# EAGLE design LED sign Control board FINAL (EAGLE 7.2.0)
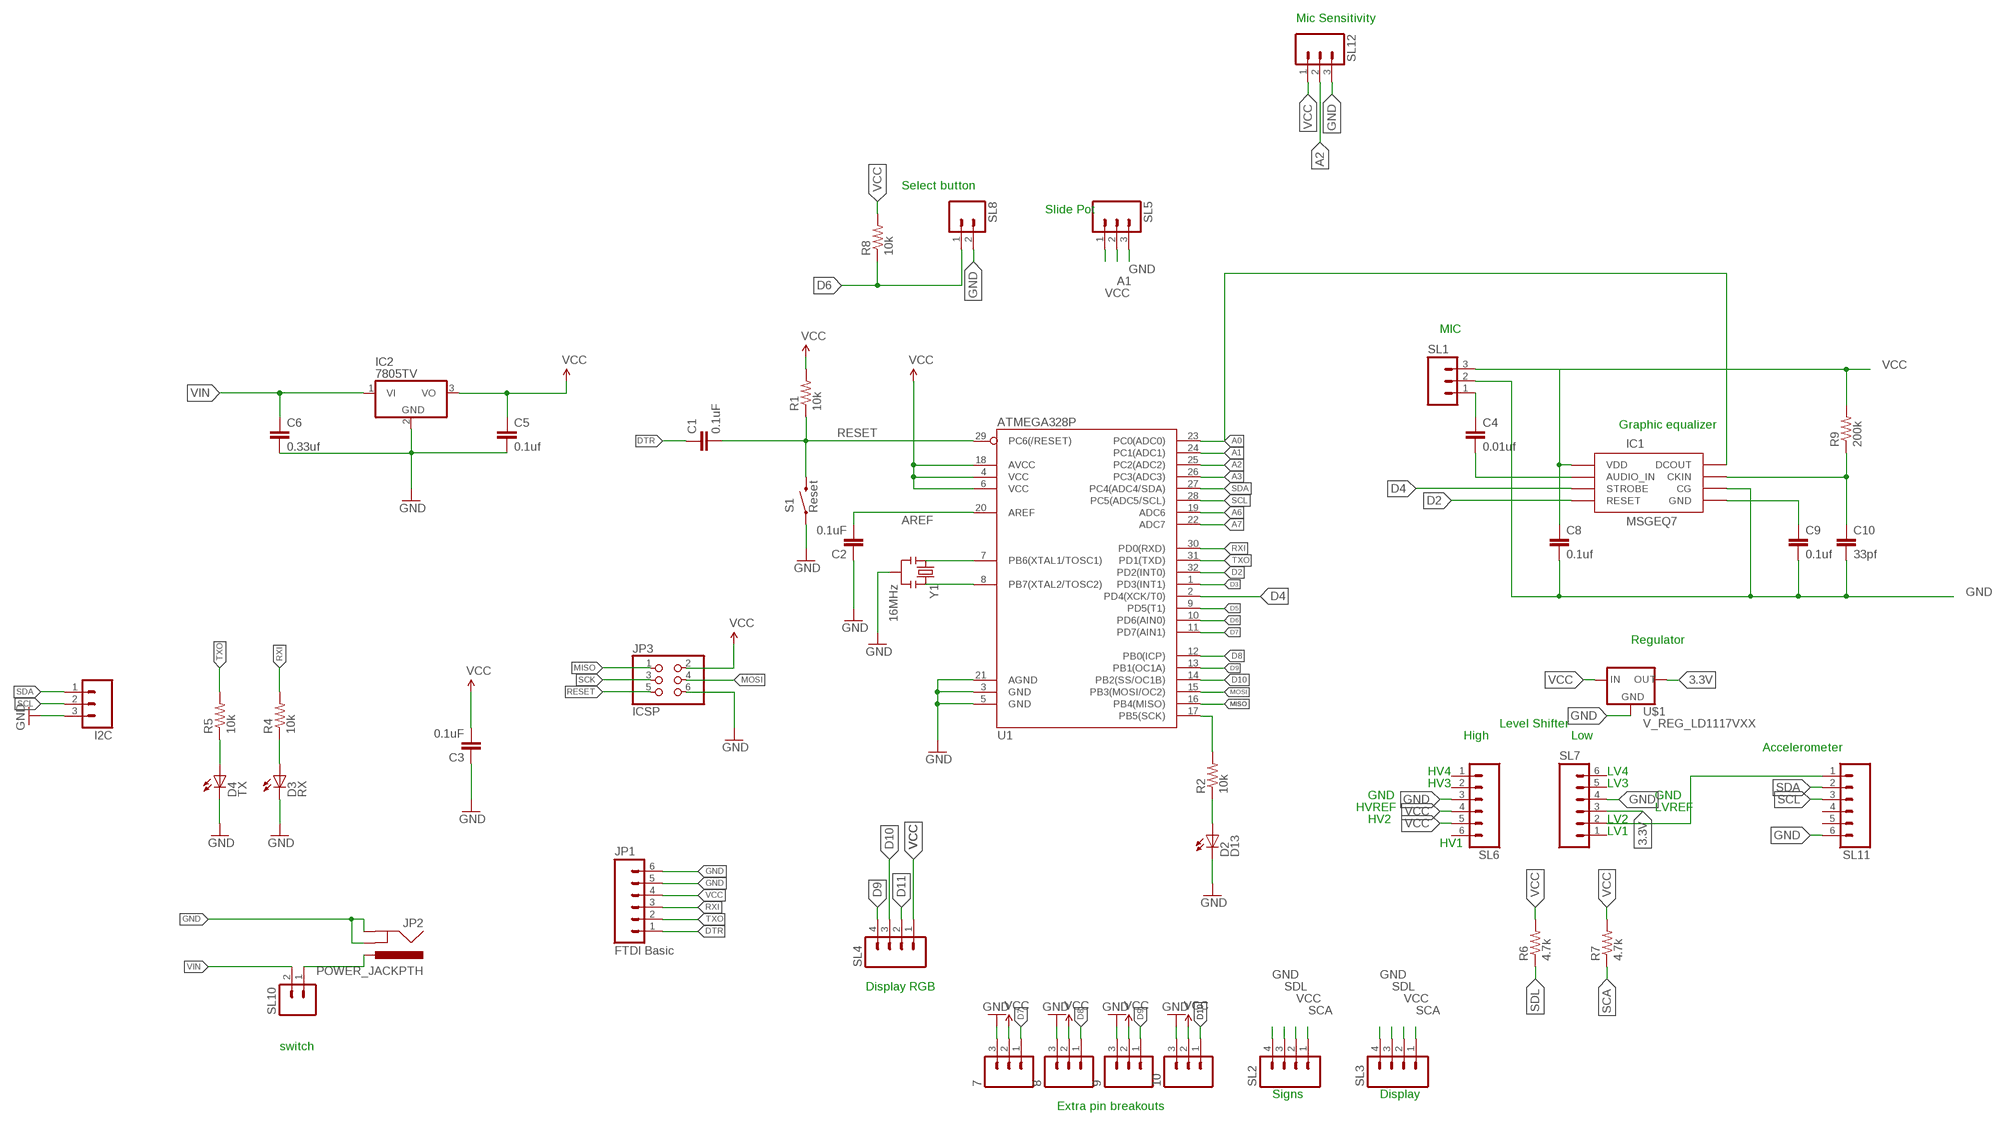
[diagram p0: schematic, sheet 1]

## Parts
7  M03PTH  [1X03]
8  M03PTH  [1X03]
9  M03PTH  [1X03]
10  M03PTH  [1X03]
C1  0.1uF  CAP0603-CAP  [0603-CAP]
C2  0.1uF  CAP0603-CAP  [0603-CAP]
C3  0.1uF  CAP0603-CAP  [0603-CAP]
C4  0.01uf  C2,5-3  [C2.5-3]
C5  0.1uf  C2,5-3  [C2.5-3]
C6  0.33uf  C2,5-3  [C2.5-3]
C8  0.1uf  C2,5-3  [C2.5-3]
C9  0.1uf  C2,5-3  [C2.5-3]
C10  33pf  C2,5-3  [C2.5-3]
D2  D13  LED-RED0603  [LED-0603]
D3  RX  LED-GREEN0603  [LED-0603]
D4  TX  LED-RED0603  [LED-0603]
I2C  M03PTH  [1X03]
IC1  MSGEQ7DIL  [DIL-08]
IC2  7805TV  [TO220V]
JP1  FTDI Basic  M06SIP  [1X06]
JP2  POWER_JACKPTH  [POWER_JACK_PTH]
JP3  ICSP  PINHD-2X3  [2X03]
R1  10k  RESISTOR0603-RES  [0603-RES]
R2  10k  RESISTOR0603-RES  [0603-RES]
R4  10k  RESISTOR0603-RES  [0603-RES]
R5  10k  RESISTOR0603-RES  [0603-RES]
R6  4.7k  RESISTOR1206  [1206]
R7  4.7k  RESISTOR1206  [1206]
R8  10k  RESISTOR1206  [1206]
R9  200k  RESISTOR1206  [1206]
S1  Reset  SWITCH-MOMENTARY-2SMD  [TACTILE_SWITCH_SMD]
SL1  M03  [03P]
SL2  M04  [04P]
SL3  M04  [04P]
SL4  M04  [04P]
SL5  M03  [03P]
SL6  M06  [06P]
SL7  M06  [06P]
SL8  M02  [02P]
SL10  M02  [02P]
SL11  M06  [06P]
SL12  M03  [03P]
U1  ATMEGA328P  ATMEGA328_SMT  [TQFP32-08]
U$1  V_REG_LD1117VXX  [78XXL]
Y1  16MHz  RESONATOR16MHZ  [RESONATOR-SMD]

## Nets
3.3V: SL7.3 U$1.GND(OUT)
A0: IC1.3(DCOUT) U1.23(PC0(ADC0))
A1: SL5.2 U1.24(PC1(ADC1))
A2: SL12.2 U1.25(PC2(ADC2))
A3: U1.26(PC3(ADC3))
A6: U1.19(ADC6)
A7: U1.22(ADC7)
AREF: C2.2 U1.20(AREF)
D2: IC1.7(RESET) U1.32(PD2(INT0))
D3: U1.1(PD3(INT1))
D4: IC1.4(STROBE) U1.2(PD4(XCK/T0))
D5: U1.9(PD5(T1))
D6: R8.1 SL8.1 U1.10(PD6(AIN0))
D7: 7.1 U1.11(PD7(AIN1))
D8: 8.1 U1.12(PB0(ICP))
D9: 9.1 SL4.4 U1.13(PB1(OC1A))
D10: 10.1 SL4.3 U1.14(PB2(SS/OC1B))
D11: SL4.2
DTR: C1.1 JP1.1
GND: 7.3 8.3 9.3 10.3 C2.1 C3.1 C5.2 C6.2 C8.2 C9.2 C10.2 D2.C D3.C D4.C I2C.3 IC1.6(CG) IC2.2(GND) JP1.5 JP1.6 JP2.GND JP2.GNDBREAK JP3.6 S1.1 SL1.2 SL2.4 SL3.4 SL5.3 SL6.3 SL7.4 SL8.2 SL11.6 SL12.3 U1.3(GND) U1.5(GND) U1.21(AGND) U$1.IN(GND) Y1.2
MISO: JP3.1 U1.16(PB4(MISO))
MOSI: JP3.4 U1.15(PB3(MOSI/OC2))
N$1: U1.7(PB6(XTAL1/TOSC1)) Y1.1
N$2: U1.8(PB7(XTAL2/TOSC2)) Y1.3
N$4: D2.A R2.1
N$5: D3.A R4.1
N$6: D4.A R5.1
N$8: JP2.PWR SL10.1
N$9: C4.1 SL1.1
N$10: C4.2 IC1.5(AUDIO_IN)
N$11: C9.1 IC1.2(GND)
N$12: C10.1 IC1.8(CKIN) R9.1
N$13: R2.2 U1.17(PB5(SCK))
N$15: SL7.2 SL11.1
RESET: C1.2 JP3.5 R1.1 S1.3 U1.29(PC6(/RESET))
RXI: JP1.3 R4.2 U1.30(PD0(RXD))
SCA: R7.1 SL2.1 SL3.1
SCK: JP3.3
SCL: I2C.2 SL11.3 U1.28(PC5(ADC5/SCL))
SDA: I2C.1 SL11.2 U1.27(PC4(ADC4/SDA))
SDL: R6.1 SL2.3 SL3.3
TXO: JP1.2 R5.2 U1.31(PD1(TXD))
VCC: 7.2 8.2 9.2 10.2 C3.2 C5.1 C8.1 IC1.1(VDD) IC2.3(VO) JP1.4 JP3.2 R1.2 R6.2 R7.2 R8.2 R9.2 SL1.3 SL2.2 SL3.2 SL4.1 SL5.1 SL6.4 SL6.5 SL12.1 U1.4(VCC) U1.6(VCC) U1.18(AVCC) U$1.OUT(IN)
VIN: C6.1 IC2.1(VI) SL10.2
Unconnected: SL6.1 SL6.2 SL6.6 SL7.1 SL7.5 SL7.6 SL11.4 SL11.5

## Notes on the sheet
- Mic Sensitivity
- Select button
- Slide Pot
- MIC
- Graphic equalizer
- Regulator
- Level Shifter
- High | Low
- Accelerometer
- HV4 | LV4
- HV3 | LV3
- GND | GND
- HVREF | LVREF
- HV2 | LV2
- LV1
- HV1
- Display RGB
- switch
- Signs | Display
- Extra pin breakouts

## Library data of the parts
7-10 I2C = SparkFun-Connectors:M03: Header 3 Standard 3-pin 0.1" header. Use with straight break away headers (SKU : PRT-00116), right angle break away headers (PRT-00553), swiss pins (PRT-00743), machine pins (PRT-00117), and female headers (PRT-00115). Molex polarized connector foot print use with SKU : PRT-08232 with associated crimp pins and housings.
C1-C3 = SparkFun-Passives:CAP: Capacitor Standard 0603 ceramic capacitor, and 0.1" leaded capacitor.
C4-C6 C8-C10 = capacitor-wima:C: CAPACITOR naming: grid - package width
D2 D4 = SparkFun-LED:LED-RED: Assorted Red LEDs LilyPad 1206- DIO-09912 1206- DIO-00809 0603- DIO-00819; PROD_ID: DIO-00819; VALUE: RED
D3 = SparkFun-LED:LED-GREEN: Various green LEDs Green LEDs used in SFE Production 0603- DIO-00821 LARGE- DIO-00862 LILYPAD- DIO-09910; PROD_ID: DIO-00821; VALUE: GREEN
IC1 = SparkFun-AnalogIC:MSGEQ7: 7-band graphic equalizer
IC2 = linear:78*: Positive VOLTAGE REGULATOR Source: http://cache.national.com/ds/LM/LM78L05.pdf http://www.fairchildsemi.com/ds/LM/LM7805.pdf
JP1 = SparkFun-Connectors:M06: Header 6 Standard 6-pin 0.1" header. Use with straight break away headers (SKU : PRT-00116), right angle break away headers (PRT-00553), swiss pins (PRT-00743), machine pins (PRT-00117), and female headers (PRT-00115). Molex polarized connector foot print use with SKU : PRT-08094 with associated crimp pins and housings. NOTES ON THE VARIANTS LOCK and LOCK_LONGPADS... This footprint was designed to help hold the alignment of a through-hole component (i.e. 6-pin header) while soldering it into place. You may notice that each hole has been shifted either up or down by 0.005 of an inch from it's more standard position (which is a perfectly straight line). This slight alteration caused the pins (the squares in the middle) to touch the edges of the holes. Because they are alternating, it causes a "brace" to hold the component in place. 0.005 has proven to be the perfect amount of "off-center" position when using our standard breakaway headers. Although looks a little odd when you look at the bare footprint, once you have a header in there, the alteration is very hard to notice. Also,if you push a header all the way into place, it is covered up entirely on the bottom side. This idea of altering the position of holes to aid alignment will be further integrated into the Sparkfun Library for other footprints. It can help hold any component with 3 or more connection pins.
JP2 = SparkFun-Connectors:POWER_JACK: Power Jack This is the standard 5.5mm barrel jack for power. The PTH is the most common, proven, reliable, footprint. The Slot footprint only works if the mill layer is transmitted to the PCB fab house so be warned. Mating wall wart : TOL-00298 (and others); PROD_ID: CONN-08197
JP3 = SparkFun-Connectors:PINHD-2X3: PIN HEADER
R1 R2 R4 R5 = SparkFun-Passives:RESISTOR: Resistor Basic schematic elements and footprints for 0603, 1206, and PTH resistors.
R6-R9 = SparkFun-Resistors:RESISTOR: Resistor Basic schematic elements and footprints for 0603, 1206, and PTH resistors.
S1 = SparkFun-Electromechanical:SWITCH-MOMENTARY-2: Various NO switches- pushbuttons, reed, etc; PROD_ID: SWCH-08247
SL1 SL5 SL12 = con-amp-quick:M03: AMP QUICK CONNECTOR; OC_FARNELL: unknown; OC_NEWARK: unknown
SL2-SL4 = con-amp-quick:M04: AMP QUICK CONNECTOR; OC_FARNELL: unknown; OC_NEWARK: unknown
SL6 SL7 SL11 = con-amp-quick:M06: AMP QUICK CONNECTOR; OC_FARNELL: unknown; OC_NEWARK: unknown
SL8 SL10 = con-amp-quick:M02: AMP QUICK CONNECTOR; OC_FARNELL: unknown; OC_NEWARK: unknown
U1 = SparkFun-DigitalIC:ATMEGA328_SMT: 32-Pin Atmega328 part Commonly used on Arduino compatible boards Available in QFP and QFN packages TQFP is IC-09069 QFN is non-stock; PROD_ID: IC-09069
U$1 = SparkFun-PowerIC:V_REG_LD1117VXX: LD1117VXX voltage regulator. We carry the 3.3V version (COM-00526) in TO-220 package.
Y1 = SparkFun-FreqCtrl:RESONATOR: Resonator Small SMD resonator. Used, eg, on the Arduino Pro/ Pro Mini boards. 8MHz- XTAL-08895 16MHz- XTAL-08900; PROD_ID: XTAL-08900

## Board
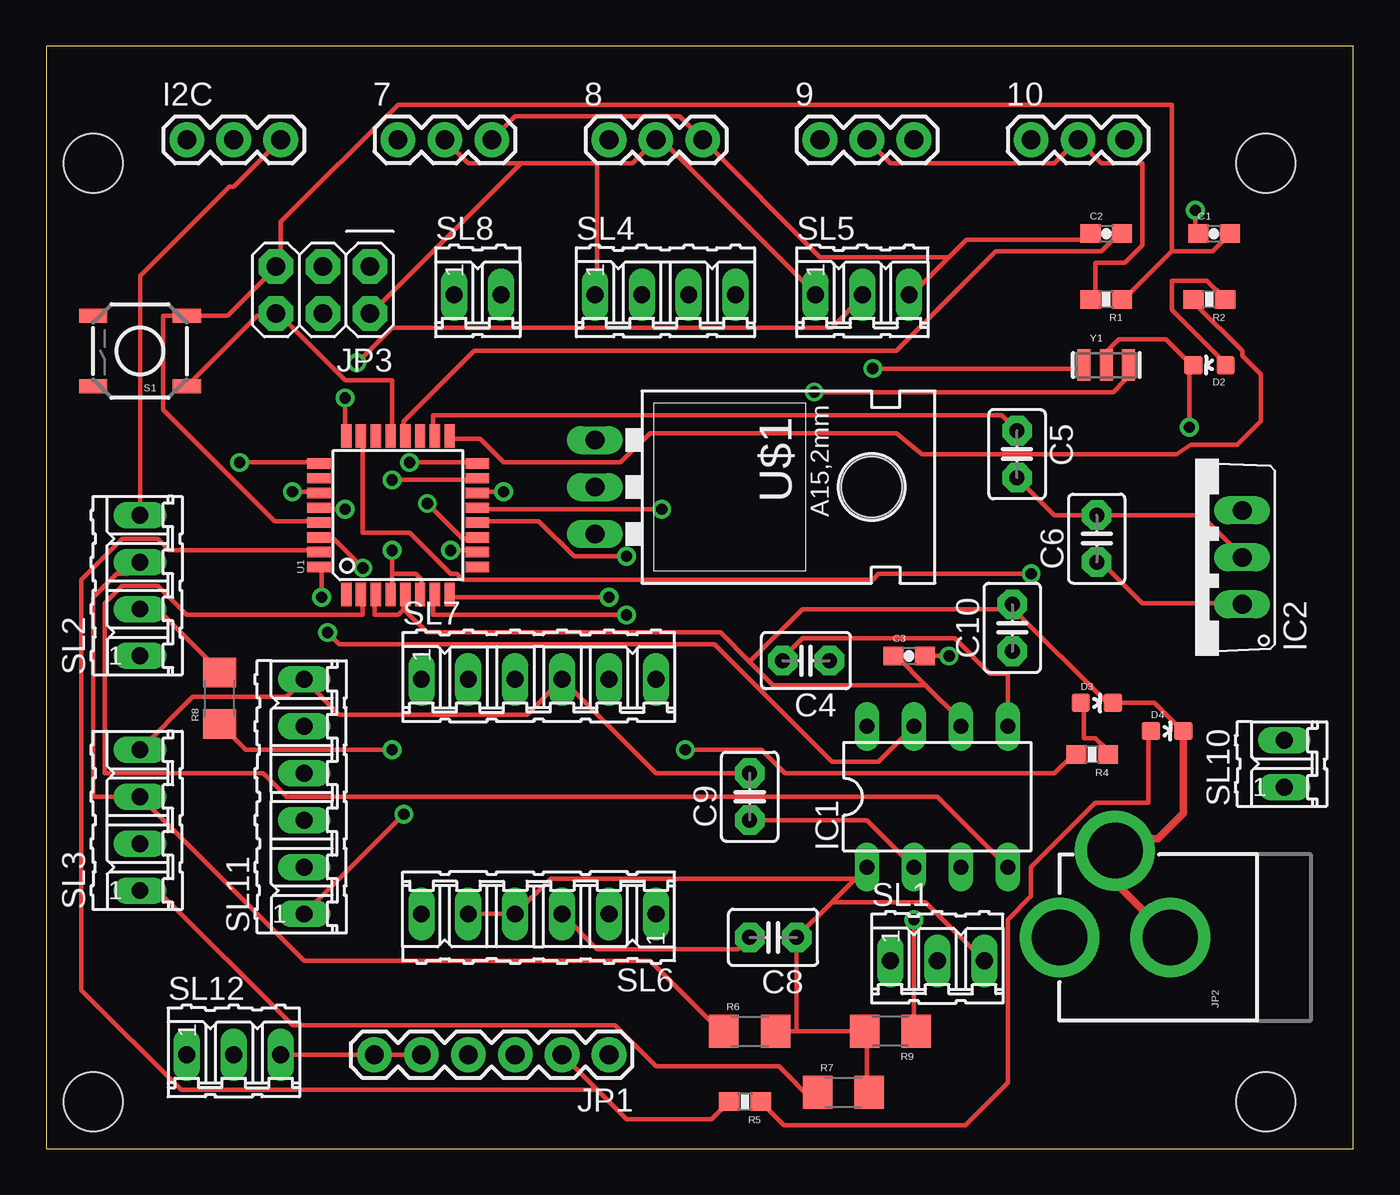
[diagram p1: board, top side]
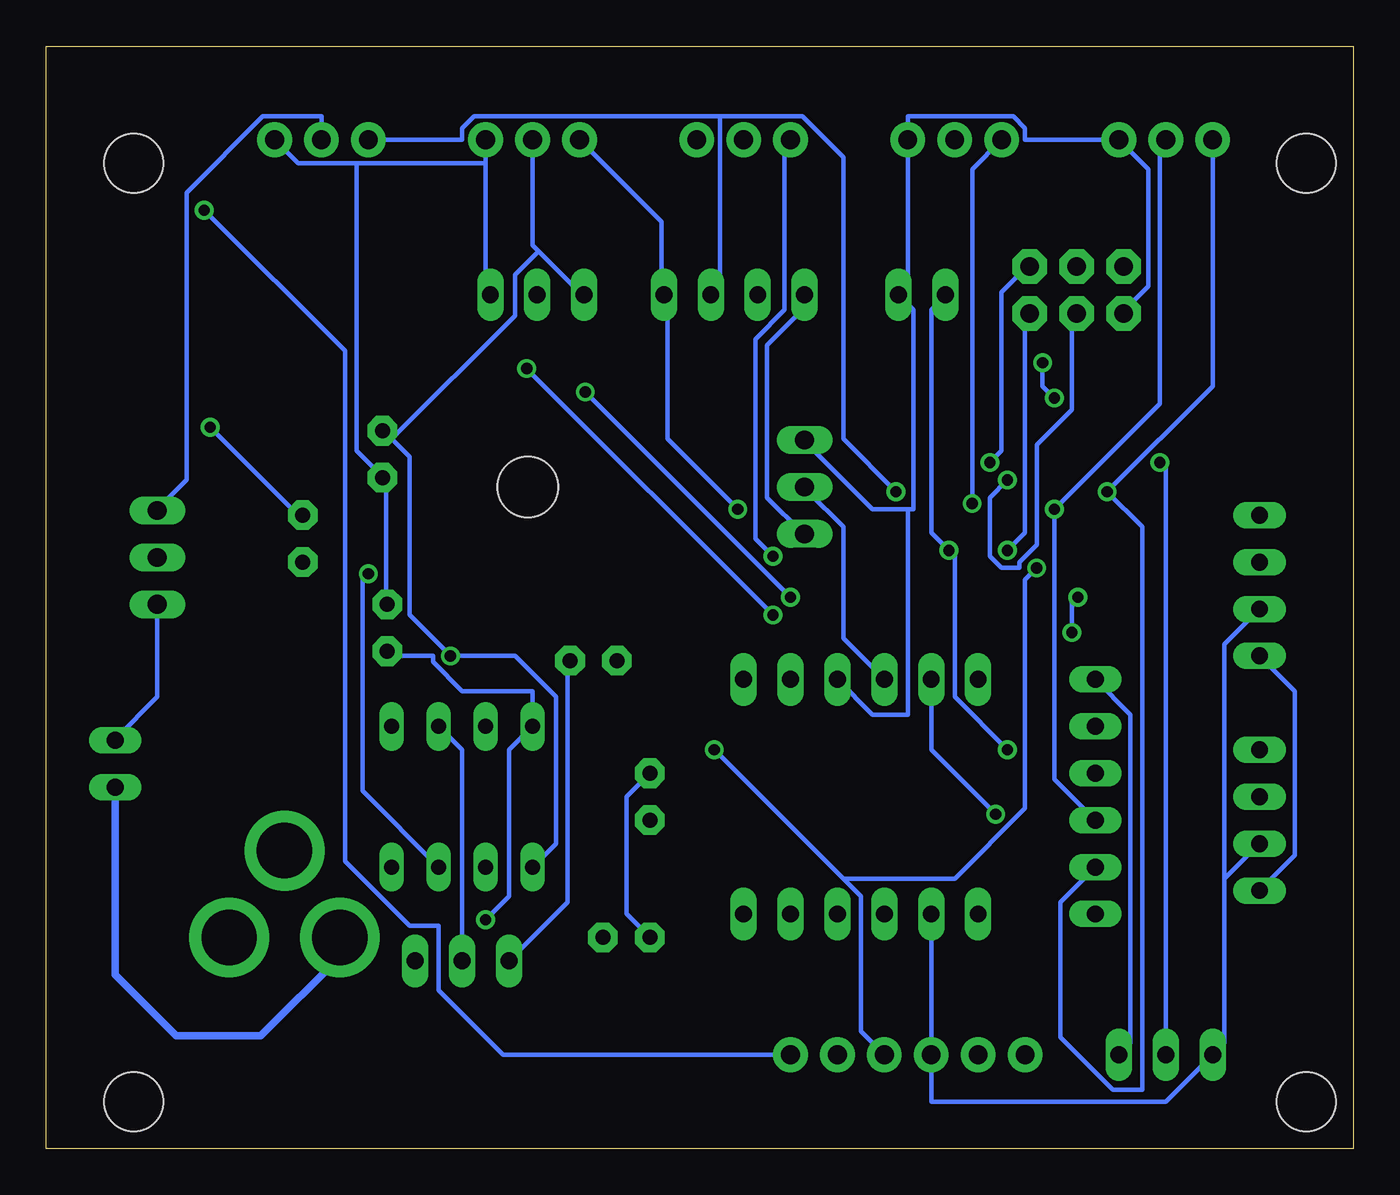
[diagram p2: board, bottom side, seen from below]

Size 70.79 x 59.68 mm. Coordinates in mm from the lower left corner, seen from the top.
Outline: 0,0 70.79,0 70.79,59.68 0,59.68 0,0
Copper layers (1*16): Top 0.035mm / dielectric 1.5mm / Bottom 0.035mm
Design rules "default": minimum track width 10mil, minimum drill 24mil, track to track 8mil, track to pad 8mil, pad to pad 8mil, via to via 8mil, smd to smd 8mil, copper to edge 40mil, drill to drill 8mil, minimum pad ring 10mil, minimum via ring 8mil, stop-mask expansion 4mil, vias tented up to drill 0mil, thermal gap 10mil
Holes 3.2 mm at 2.54,2.54 66.04,2.54 2.54,53.34 66.04,53.34

### Footprints (pad centres in the part's own frame; a part is rotated, then mirrored left to right if it is on the bottom)
1X03 = drill 1.016 pad 1.88: 1 0,0; 2 2.54,0; 3 5.08,0
0603-CAP = smd 1.1 x 1: 1 -0.85,0; 2 0.85,0
C2.5-3 = drill 0.813 pad 1.6 octagon: 1 -1.27,0; 2 1.27,0
LED-0603 = smd 1 x 1: A 0,-0.877; C 0,0.877
DIL-08 = drill 0.813 long: 1 -3.81,-3.81; 2 -1.27,-3.81; 3 1.27,-3.81; 4 3.81,-3.81; 5 3.81,3.81; 6 1.27,3.81; 7 -1.27,3.81; 8 -3.81,3.81
TO220V = drill 1.016 long: 1 -2.54,-2.54; 2 0,-2.54; 3 2.54,-2.54
1X06 = drill 1.016 pad 1.88: 1 0,0; 2 2.54,0; 3 5.08,0; 4 7.62,0; 5 10.16,0; 6 12.7,0
POWER_JACK_PTH = drill 2.997 pad 4.318: GND 0,7.7; GNDBREAK 4.7,10.7; PWR 0,13.7
2X03 = drill 1.016 pad 1.88 octagon: 1 -2.54,-1.27; 2 -2.54,1.27; 3 0,-1.27; 4 0,1.27; 5 2.54,-1.27; 6 2.54,1.27
0603-RES = smd 1.1 x 1: 1 -0.85,0; 2 0.85,0
1206 = smd 1.6 x 1.8: 1 -1.4,0; 2 1.4,0
TACTILE_SWITCH_SMD = smd 1.524 x 0.762: 1 -2.54,1.905; 2 2.54,1.905; 3 -2.54,-1.905; 4 2.54,-1.905
03P = drill 0.914 long: 1 -2.54,0; 2 0,0; 3 2.54,0
04P = drill 0.914 long: 1 -3.81,0; 2 -1.27,0; 3 1.27,0; 4 3.81,0
06P = drill 0.914 long: 1 -6.35,0; 2 -3.81,0; 3 -1.27,0; 4 1.27,0; 5 3.81,0; 6 6.35,0
02P = drill 0.914 long: 1 -1.27,0; 2 1.27,0
TQFP32-08 = smd 1.27 x 0.559: 1 -4.293,2.8; 2 -4.293,2; 3 -4.293,1.2; 4 -4.293,0.4; 5 -4.293,-0.4; 6 -4.293,-1.2; 7 -4.293,-2; 8 -4.293,-2.8; 17 4.293,-2.8; 18 4.293,-2; 19 4.293,-1.2; 20 4.293,-0.4; 21 4.293,0.4; 22 4.293,1.2; 23 4.293,2; 24 4.293,2.8 | smd 0.559 x 1.27: 9 -2.8,-4.293; 10 -2,-4.293; 11 -1.2,-4.293; 12 -0.4,-4.293; 13 0.4,-4.293; 14 1.2,-4.293; 15 2,-4.293; 16 2.8,-4.293; 25 2.8,4.293; 26 2,4.293; 27 1.2,4.293; 28 0.4,4.293; 29 -0.4,4.293; 30 -1.2,4.293; 31 -2,4.293; 32 -2.8,4.293
78XXL = drill 1.016 long: GND 0,-3.81; IN -2.54,-3.81; OUT 2.54,-3.81 | hole 3.302: 0,11.176
RESONATOR-SMD = smd 0.7 x 1.7: 1 -1.2,0; 2 0,0; 3 1.2,0

### Placement (x,y rotation side)
7  19.05,54.61 0 top
8  30.48,54.61 0 top
9  41.91,54.61 0 top
10  53.34,54.61 0 top
C1  63.25,49.53 0 top
C2  57.4,49.53 0 top
C3  46.74,26.67 0 top
C4  41.15,26.42 180 top
C5  52.58,37.59 270 top
C6  56.9,33.02 90 top
C8  39.37,11.43 180 top
C9  38.1,19.05 90 top
C10  52.32,28.19 90 top
D2  62.99,42.42 90 top
D3  56.9,24.13 270 top
D4  60.71,22.61 270 top
I2C  7.62,54.61 0 top
IC1  48.26,19.05 0 top
IC2  62.23,32 90 top
JP1  30.48,5.08 180 top
JP2  68.58,11.43 90 top
JP3  14.99,46.48 180 top
R1  57.4,45.97 180 top
R2  62.99,45.97 180 top
R4  56.64,21.34 180 top
R5  37.85,2.54 180 top
R6  38.1,6.35 0 top
R7  43.18,3.05 0 top
R8  9.4,24.38 90 top
R9  45.72,6.35 180 top
S1  5.08,43.18 180 top
SL1  48.26,10.16 0 top
SL2  5.08,30.48 90 top
SL3  5.08,17.78 90 top
SL4  33.53,46.23 0 top
SL5  44.2,46.23 0 top
SL6  26.67,12.7 180 top
SL7  26.67,25.4 0 top
SL8  23.37,46.23 0 top
SL10  67.06,20.83 90 top
SL11  13.97,19.05 90 top
SL12  10.16,5.08 0 top
U1  19.05,34.29 90 top
U$1  33.53,35.81 270 top
Y1  57.4,42.42 0 top

### Tracks (layer width: path | path; a pad name or v marks a point on that pad's centre or on a via)
3.3V
  Bottom 0.254: SL7.3 27.62,27.62 27.62,33.66 29.53,35.56 U$1.GND
A0  (via drill 0.61)
  Top 0.254: v53.34,31.11 45.09,31.11 44.77,30.8 22.54,30.8 22.23,31.11 21.91,31.11 19.68,33.34 17.14,33.34 17.14,38.42 U1.23
  Bottom 0.254: v53.34,31.11 53.66,30.8 53.66,19.37 IC1.3
A1  (via drill 0.61)
  Top 0.254: v16.19,40.64 16.19,38.74 U1.24 | v16.83,42.55 18.73,44.45 42.55,44.45 44.13,46.04 SL5.2
  Bottom 0.254: v16.19,40.64 16.83,41.28 v16.83,42.55
A2  (via drill 0.61)
  Top 0.254: v10.48,37.15 14.61,37.15 U1.25
  Bottom 0.254: v10.48,37.15 10.16,36.83 SL12.2
AREF
  Top 0.254: C2.2 58.1,49.53 57.15,48.58 51.44,48.58 46.04,43.18 23.18,43.18 19.37,39.37 19.37,38.74 U1.20
D2  (via drill 0.61)
  Top 0.254: v14.92,29.84 14.92,31.43 U1.32 | v15.24,27.94 15.88,27.3 36.2,27.3 42.55,20.95 45.09,20.95 IC1.7
  Bottom 0.254: v14.92,29.84 15.24,29.53 v15.24,27.94
D4
  Top 0.254: IC1.4 48.26,19.05 13.02,19.05 11.75,20.32 3.17,20.32 3.17,29.53 4.13,30.48 6.03,30.48 7.62,28.89 17.14,28.89 17.14,29.84 U1.2
D6  (via drill 0.61)
  Top 0.254: v21.91,32.38 23.18,32.38 U1.10 | v18.73,21.59 10.79,21.59 9.53,22.86 R8.1
  Bottom 0.254: SL8.1 22.23,46.04 22.86,45.4 22.86,33.34 v21.91,32.38 21.59,32.07 21.59,24.45 v18.73,21.59
D7  (via drill 0.61)
  Top 0.254: v20.64,34.93 22.54,33.02 23.18,33.02 U1.11
  Bottom 0.254: v20.64,34.93 20.64,53.02 7.1
D8  (via drill 0.61)
  Top 0.254: v31.43,32.07 28.57,32.07 26.67,33.97 23.5,33.97 U1.12
  Bottom 0.254: v31.43,32.07 32.38,33.02 32.38,43.82 30.8,45.4 30.8,54.29 8.1
D9  (via drill 0.61)
  Top 0.254: v33.34,34.61 23.5,34.61 U1.13
  Bottom 0.254: v33.34,34.61 37.15,38.42 37.15,46.04 SL4.4 37.47,46.36 37.47,50.17 9.1
D10  (via drill 0.61)
  Top 0.254: v24.77,35.56 23.5,35.56 U1.14
  Bottom 0.254: v24.77,35.56 27.62,38.42 27.62,53.66 29.84,55.88 34.29,55.88 | 34.29,55.88 34.29,46.67 34.61,46.36 SL4.3 | 10.1 48.26,54.61 48.26,55.25 47.62,55.88 34.29,55.88
DTR  (via drill 0.61)
  Top 0.254: v62.23,50.8 62.23,49.53 C1.1
  Bottom 0.254: v62.23,50.8 54.61,43.18 54.61,15.56 51.12,12.06 49.53,12.06 49.53,8.57 46.04,5.08 JP1.1
GND  (via drill 0.61)
  Top 0.254: SL6.3 29.84,10.79 37.47,10.79 C8.2 | C9.2 33.02,20.32 SL7.4 26.04,23.5 15.88,23.5 SL11.6 13.02,24.45 7.94,24.45 SL3.4 | SL12.3 JP1.6 JP1.5 | 19.37,29.21 19.05,28.89 17.78,28.89 17.78,29.84 U1.3 | 19.37,29.21 19.37,29.84 U1.5 | 47.62,25.08 49.53,23.18 IC1.6 | 47.62,25.08 46.04,26.67 C3.1 | 19.37,29.21 20.64,27.94 36.51,27.94 38.1,26.35 | 38.1,26.35 39.37,25.08 47.62,25.08 | D4.C 61.28,22.86 60.01,24.13 D3.C 57.47,24.13 52.39,29.21 C10.2 52.07,29.21 40.96,29.21 38.1,26.35 | Y1.2 57.47,42.55 57.47,43.18 58.1,43.82 60.64,43.82 61.91,42.55 D2.C 61.91,42.23 v61.91,39.05 | IC2.2 64.77,32.07 62.55,34.29 C6.2 54.61,34.29 C5.2 | U1.21 18.73,38.74 18.73,41.59 16.19,41.59 12.7,45.09 JP3.6 12.38,45.09 11.43,45.09 S1.1 | I2C.3 10.16,52.07 9.91,52.07 5.08,47.24 SL2.4 | 48.9,48.26 46.99,46.36 SL5.3 | 48.9,48.26 49.85,49.21 56.2,49.21 56.52,49.53 C2.1 | 48.9,48.26 41.91,48.26 8.3 34.29,55.88 25.4,55.88 7.3
  Top 0.406: D4.C 61.58,18.15 60.2,16.76 58.51,16.76 JP2.GNDBREAK 57.88,14.43 JP2.GND
  Bottom 0.254: C8.2 39.37,12.7 39.37,19.05 C9.2 | SL12.3 12.06,5.71 12.06,23.5 SL11.6 | SL1.2 48.26,21.59 IC1.6 | v61.91,39.05 57.15,34.29 C6.2 | C10.2 52.39,29.53 52.39,36.2 C5.2 52.7,36.51 53.98,37.78 53.98,53.34 | JP3.6 12.38,45.4 11.11,46.67 11.11,53.02 I2C.3 17.78,54.61 17.78,55.25 18.41,55.88 24.13,55.88 7.3 24.13,46.67 24.45,46.36 SL8.2 23.81,45.4 23.81,34.61 24.13,34.61 | 24.13,34.61 26.04,34.61 29.53,38.1 U$1.IN | 46.99,53.34 46.99,46.36 SL5.3 | 46.99,53.34 9.3 | 10.3 57.15,53.34 53.98,53.34 | 46.99,53.34 53.98,53.34 | SL7.4 26.04,23.5 24.13,23.5 24.13,34.61
MISO  (via drill 0.61)
  Top 0.254: v19.68,37.15 23.18,37.15 U1.16
  Bottom 0.254: v19.68,37.15 19.05,37.78 19.05,46.36 17.78,47.62 JP3.1
MOSI  (via drill 0.61)
  Top 0.254: v18.73,36.2 23.18,36.2 U1.15
  Bottom 0.254: v18.73,36.2 19.68,35.24 19.68,32.07 19.05,31.43 18.1,31.43 18.1,31.75 17.14,32.7 17.14,38.1 15.24,40.01 15.24,45.09 JP3.4
N$1  (via drill 0.61)
  Top 0.254: v31.43,28.89 20.95,28.89 20.95,29.84 U1.7 | v44.77,42.23 56.2,42.23 Y1.1
  Bottom 0.254: v44.77,42.23 v31.43,28.89
N$2  (via drill 0.61)
  Top 0.254: v30.48,29.84 21.91,29.84 U1.8 | v41.59,40.96 57.78,40.96 58.42,41.59 58.42,42.23 Y1.3
  Bottom 0.254: v41.59,40.96 v30.48,29.84
N$4
  Top 0.254: D2.A 63.82,42.55 60.96,45.4 60.96,46.99 62.87,46.99 63.82,46.04 R2.1
N$5
  Top 0.254: D3.A 56.2,24.13 56.2,22.22 56.83,22.22 57.47,21.59 R4.1
N$6
  Top 0.254: D4.A 59.69,22.54 59.69,18.73 56.83,18.73 53.34,15.24 53.34,13.65 52.07,12.38 52.07,3.56 49.78,1.27 39.97,1.27 R5.1
N$8
  Bottom 0.406: JP2.PWR 54.88,10.4 59.18,6.1 63.75,6.1 67.06,9.4 SL10.1
N$9
  Bottom 0.254: SL1.1 42.55,13.33 42.55,26.35 C4.1
N$10
  Top 0.254: IC1.5 52.07,25.72 51.12,25.72 49.21,27.62 40.96,27.62 40.01,26.67 C4.2
N$11
  Top 0.254: IC1.2 44.45,17.78 C9.1
N$12  (via drill 0.61)
  Top 0.254: v46.99,12.38 46.99,6.35 R9.1
  Bottom 0.254: v46.99,12.38 45.72,13.65 45.72,21.59 IC1.8 44.45,24.77 48.26,24.77 49.85,26.35 49.85,26.67 52.07,26.67 C10.1
N$13
  Top 0.254: R2.2 62.23,45.72 64.77,43.18 64.77,42.93 65.79,41.91 65.79,39.37 64.52,38.1 61.98,38.1 61.21,37.59 47.43,37.59 46.04,38.74 32.7,38.74 31.11,37.15 24.77,37.15 23.5,38.42 21.91,38.42 U1.17
N$15  (via drill 0.61)
  Top 0.254: v19.37,18.1 SL11.1
  Bottom 0.254: v19.37,18.1 22.86,21.59 SL7.2
RESET
  Top 0.254: 60.96,48.58 58.42,46.04 R1.1 | 60.96,48.58 63.18,48.58 64.14,49.53 C1.2 | U1.29 14.61,33.97 12.38,33.97 6.35,40.01 6.35,45.09 S1.3 9.84,45.09 12.38,47.62 JP3.5 12.7,47.94 12.7,50.17 19.05,56.52 60.96,56.52 60.96,48.58
RXI  (via drill 0.61)
  Top 0.254: v34.61,21.59 38.73,21.59 40.01,20.32 54.61,20.32 55.56,21.27 R4.2 | v17.14,31.43 15.56,33.02 14.92,33.02 U1.30
  Bottom 0.254: 27.62,14.61 26.67,13.65 26.67,6.35 JP1.3 | 27.62,14.61 v34.61,21.59 | v17.14,31.43 17.78,30.8 17.78,18.41 21.59,14.61 27.62,14.61
SCA
  Top 0.254: SL3.1 6.03,13.97 13.34,6.67 30.8,6.67 33.02,4.45 39.69,4.45 41.59,2.54 R7.1
  Bottom 0.254: SL2.1 3.17,24.77 3.17,15.88 SL3.1
SCL  (via drill 0.61)
  Top 0.254: v16.19,34.61 14.92,34.61 U1.28
  Bottom 0.254: SL11.3 16.19,20 v16.19,34.61 10.48,40.32 10.48,54.29 I2C.2
SDA  (via drill 0.61)
  Top 0.254: v13.34,35.56 14.61,35.56 U1.27
  Bottom 0.254: I2C.1 7.62,41.28 v13.34,35.56 11.43,33.66 11.43,3.17 13.02,3.17 15.88,6.03 15.88,13.33 SL11.2
SDL
  Top 0.254: R6.1 36.51,6.35 32.7,10.16 13.97,10.16 SL3.3 2.54,19.05 2.54,29.84 3.81,31.11 4.45,31.11 SL2.3
TXO
  Top 0.254: JP1.2 29.84,3.17 | 29.84,3.17 31.43,1.59 36.04,1.59 R5.2 | 29.84,3.17 7.3,3.17 1.91,8.57 1.91,30.8 4.13,33.02 6.03,33.02 6.67,32.38 14.61,32.38 U1.31
VCC  (via drill 0.61)
  Top 0.254: SL2.2 6.03,29.21 9.21,26.04 R8.2 | SL6.5 SL6.4 27.3,14.61 43.81,14.61 | 40.64,6.35 R9.2 44.45,6.35 44.45,2.54 R7.2 | 40.64,6.35 R6.2 | 42.55,13.33 C8.1 40.64,6.35 | 42.55,13.33 43.81,14.61 | SL1.3 47.62,13.33 42.55,13.33 | 43.81,14.61 IC1.1 | v48.9,26.67 C3.2 | C5.1 51.75,39.69 20.95,39.69 20.95,38.74 U1.18 | R1.2 56.83,46.04 56.83,47.94 58.42,47.94 59.37,48.9 59.37,53.34 57.15,53.34 10.2 54.61,53.34 45.72,53.34 9.2 | 18.73,31.11 18.73,30.16 U1.4 | 18.73,31.11 20,31.11 20.32,30.8 20.32,30.16 U1.6 | v18.73,32.38 18.73,31.11 | 29.84,53.34 29.84,46.36 SL4.1 | 29.84,53.34 31.75,53.34 8.2 33.34,54.61 41.59,46.36 SL5.1 | 7.2 22.86,53.34 25.72,53.34 | 29.84,53.34 25.72,53.34 | 25.72,53.34 17.78,45.4 JP3.2
  Bottom 0.254: 6.99,14.61 6.99,5.71 SL12.1 10.16,2.54 22.86,2.54 JP1.4 SL6.5 | SL3.2 6.99,14.61 | SL2.2 6.99,27.3 6.99,14.61 | 52.07,38.42 52.39,38.74 C5.1 52.07,38.42 | 52.07,38.42 51.12,37.47 51.12,28.89 v48.9,26.67 45.4,26.67 43.18,24.45 43.18,16.51 IC1.1 | 10.2 55.88,55.88 59.05,55.88 63.18,51.75 63.18,36.2 64.77,34.61 IC2.3 | v18.73,32.38 17.78,33.34 17.78,45.09 JP3.2 | 44.13,48.58 44.45,48.9 9.2 | 44.13,48.58 41.91,46.36 SL5.1 | U$1.OUT 29.84,33.34 31.75,35.24 31.75,43.5 29.84,45.4 29.84,46.04 SL4.1 | 52.07,38.42 45.4,45.09 45.4,47.31 44.13,48.58
VIN
  Top 0.254: C6.1 57.15,31.75 59.37,29.53 64.77,29.53 IC2.1
  Bottom 0.254: IC2.1 64.77,24.45 66.99,22.22 SL10.2